# EAGLE design Master-Module (EAGLE 6.3)
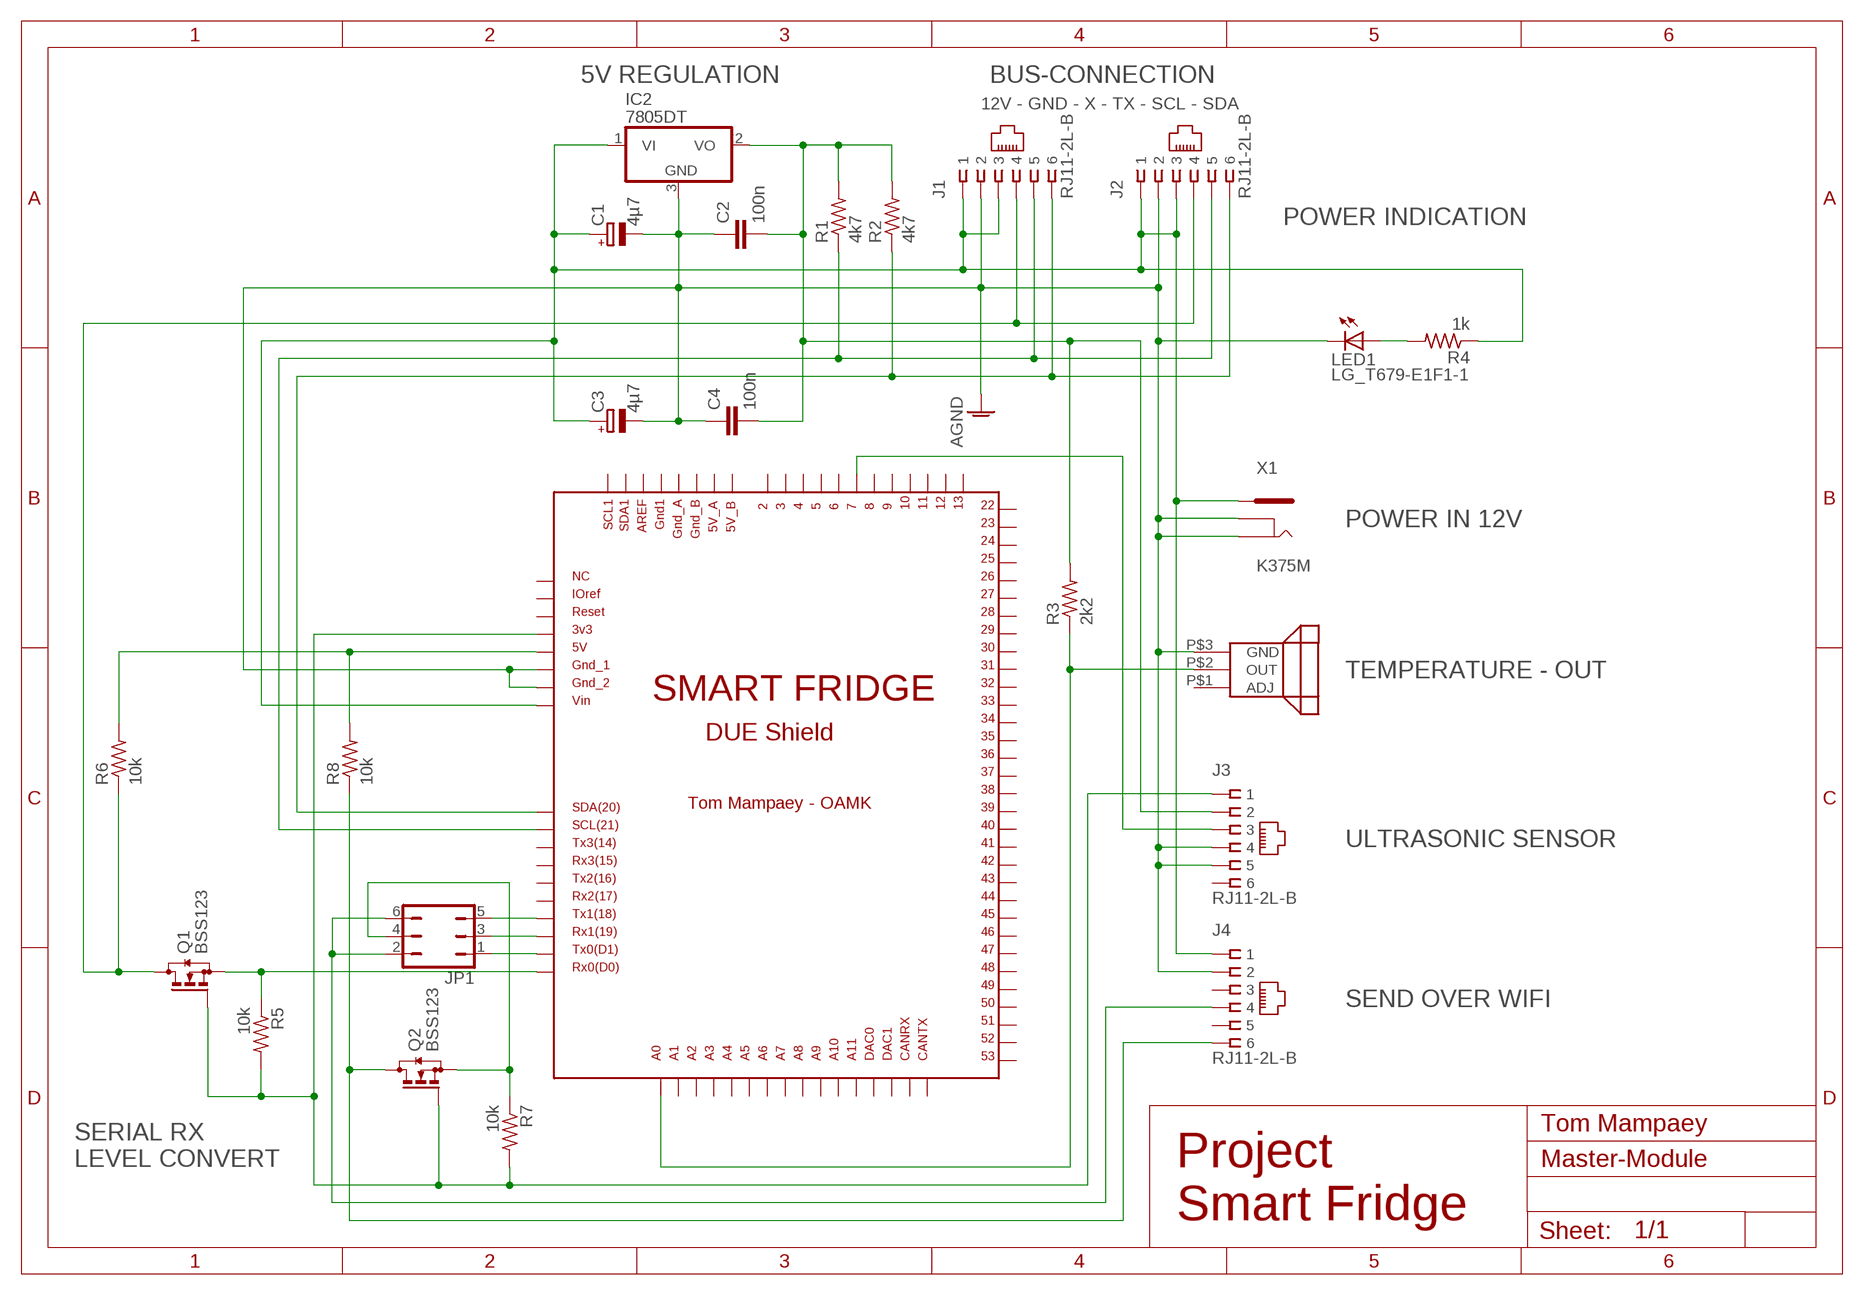
[diagram p0: schematic, sheet 1]

## Parts
C1  4µ7  CPOL-EUB  [PANASONIC_B]
C2  100n  C-EUC0603  [C0603]
C3  4µ7  CPOL-EUB  [PANASONIC_B]
C4  100n  C-EUC0603  [C0603]
IC2  7805DT  [TO252]
J1  RJ11-2L-B  [RJ11-NO_SHIELD]
J2  RJ11-2L-B  [RJ11-NO_SHIELD]
J3  RJ11-2L-B  [RJ11-NO_SHIELD]
J4  RJ11-2L-B  [RJ11-NO_SHIELD]
JP1  JP3Q  [JP3Q]
LED1  LG_T679-E1F1-1  [PLCC2]
Q1  BSS123  [SOT23]
Q2  BSS123  [SOT23]
R1  4k7  R-US_R0402  [R0402]
R2  4k7  R-US_R0402  [R0402]
R3  2k2  R-US_R0402  [R0402]
R4  1k  R-US_R0402  [R0402]
R5  10k  R-US_R0402  [R0402]
R6  10k  R-US_R0402  [R0402]
R7  10k  R-US_R0402  [R0402]
R8  10k  R-US_R0402  [R0402]
U$1  DUE(NORMAL)  [DUE(NORMAL)]
U$2  LM335  [LM335]
X1  K375M  [K375M]

## Nets
AGND: C1.- C2.1 C3.- C4.1 IC2.3(GND) J1.2 J2.2 J3.4 J3.5 J4.2 LED1.C U$1.GND_1 U$1.GND_2 U$2.P$3(GND) X1.P$1 X1.P$6
N$1: J1.6 J2.6 R2.1 U$1.SDA
N$2: J1.4 J2.4 Q1.3(D) R6.1
N$3: J1.5 J2.5 R1.1 U$1.SCL
N$4: R6.2 R8.2 U$1.5V
N$5: R3.1 U$1.A0 U$2.P$2(OUT)
N$6: J3.3 U$1.7
N$7: LED1.A R4.2
N$8: C2.2 C4.2 IC2.2(VO) J3.2 R1.2 R2.2 R3.2
N$9: Q1.2(S) R5.1 U$1.RX0
N$11: JP1.1 U$1.TX0
N$14: J3.1 Q1.1(G) Q2.1(G) R5.2 R7.2 U$1.3V3
N$30: JP1.3 U$1.RX1
N$31: JP1.5 U$1.TX1
N$33: J4.4 JP1.2 JP1.6
N$34: J4.6 Q2.3(D) R8.1
N$35: JP1.4 Q2.2(S) R7.1
N$47: C1.+ C3.+ IC2.1(VI) J1.1 J1.3 J2.1 J2.3 J4.1 R4.1 U$1.VIN X1.P$7
Unconnected: J3.6 J4.3 J4.5 U$1.2 U$1.3 U$1.4 U$1.5 U$1.5V_A U$1.5V_B U$1.6 U$1.8 U$1.9 U$1.10 U$1.11 U$1.12 U$1.13 U$1.22 U$1.23 U$1.24 U$1.25 U$1.26 U$1.27 U$1.28 U$1.29 U$1.30 U$1.31 U$1.32 U$1.33 U$1.34 U$1.35 U$1.36 U$1.37 U$1.38 U$1.39 U$1.40 U$1.41 U$1.42 U$1.43 U$1.44 U$1.45 U$1.46 U$1.47 U$1.48 U$1.49 U$1.50 U$1.51 U$1.52 U$1.53 U$1.A1 U$1.A2 U$1.A3 U$1.A4 U$1.A5 U$1.A6 U$1.A7 U$1.A8 U$1.A9 U$1.A10 U$1.A11 U$1.AREF U$1.CANRX U$1.CANTX U$1.DAC0 U$1.DAC1 U$1.GND1 U$1.GND_A U$1.GND_B U$1.IOREF U$1.NC U$1.RESET U$1.RX2 U$1.RX3 U$1.SCL1 U$1.SDA1 U$1.TX2 U$1.TX3 U$2.P$1(ADJ)

## Notes on the sheet
- 5V REGULATION | BUS-CONNECTION
- 12V - GND - X - TX - SCL - SDA
- POWER INDICATION
- POWER IN 12V
- TEMPERATURE - OUT
- ULTRASONIC SENSOR
- SEND OVER WIFI
- Tom Mampaey
- SERIAL RX 
  LEVEL CONVERT
- Project 
  Smart Fridge

## Library data of the parts
C1 C3 = resistor:CPOL-EU: POLARIZED CAPACITOR, European symbol
C2 C4 = resistor:C-EU: CAPACITOR, European symbol
IC2 = linear:78*: Positive VOLTAGE REGULATOR Source: http://cache.national.com/ds/LM/LM78L05.pdf http://www.fairchildsemi.com/ds/LM/LM7805.pdf
J1-J4 = con-tycoelectronics:RJ11: CORCOM Modular RJ Jacks No Shield Source: www.tycoelectronics.com .. ENG_DS_1654001_1099_RJ_L_0507.pdf; MF: TYCO ELECTRONICS; MPN: RJ11-2L-B; OC_FARNELL: unknown; OC_NEWARK: 83F4463
JP1 = jumper:JP3Q: JUMPER
LED1 = led:*_T679-?-1: LC TOPLED® Low Current LED Source: http://catalog.osram-os.com .. LG_LS_LY_T679_OBS.pdf; COLOR: green
Q1 Q2 = transistor-small-signal:BSS123: N-CHANNEL MOS FET
R1-R8 = rcl:R-US_: RESISTOR, American symbol
U$1 = DUE-shield custom:DUE(NORMAL)
U$2 = LM335:LM335
X1 = con-power c:K375M: K375M - DC POWER JACK 2.5mm/CENTRAL PIN Source: Data sheet <http://www.shallin.com/productview.aspx?itemnumber=K375M>

## Board
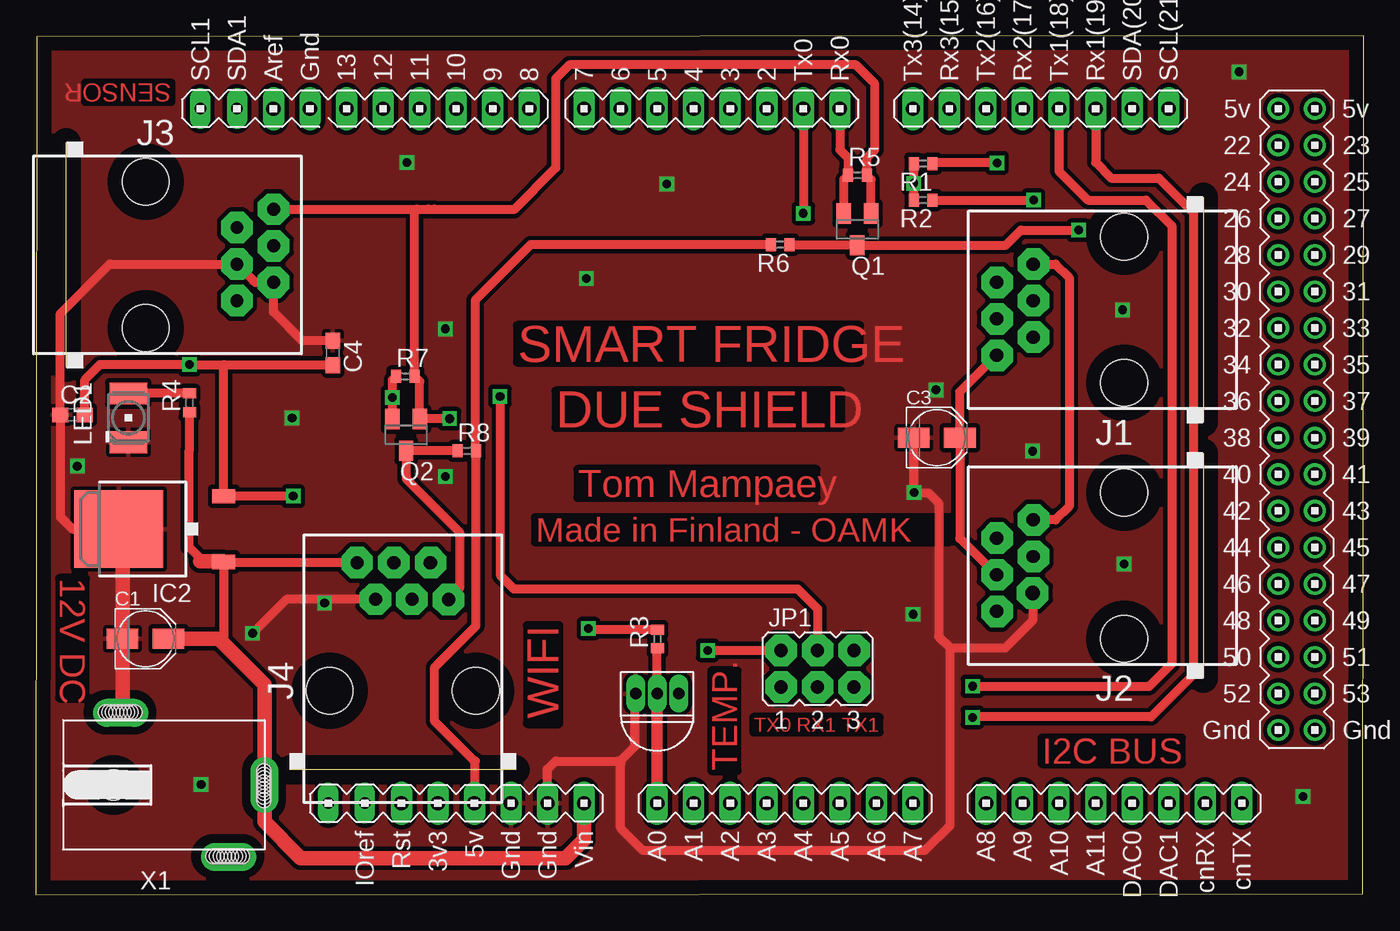
[diagram p1: board, top side]
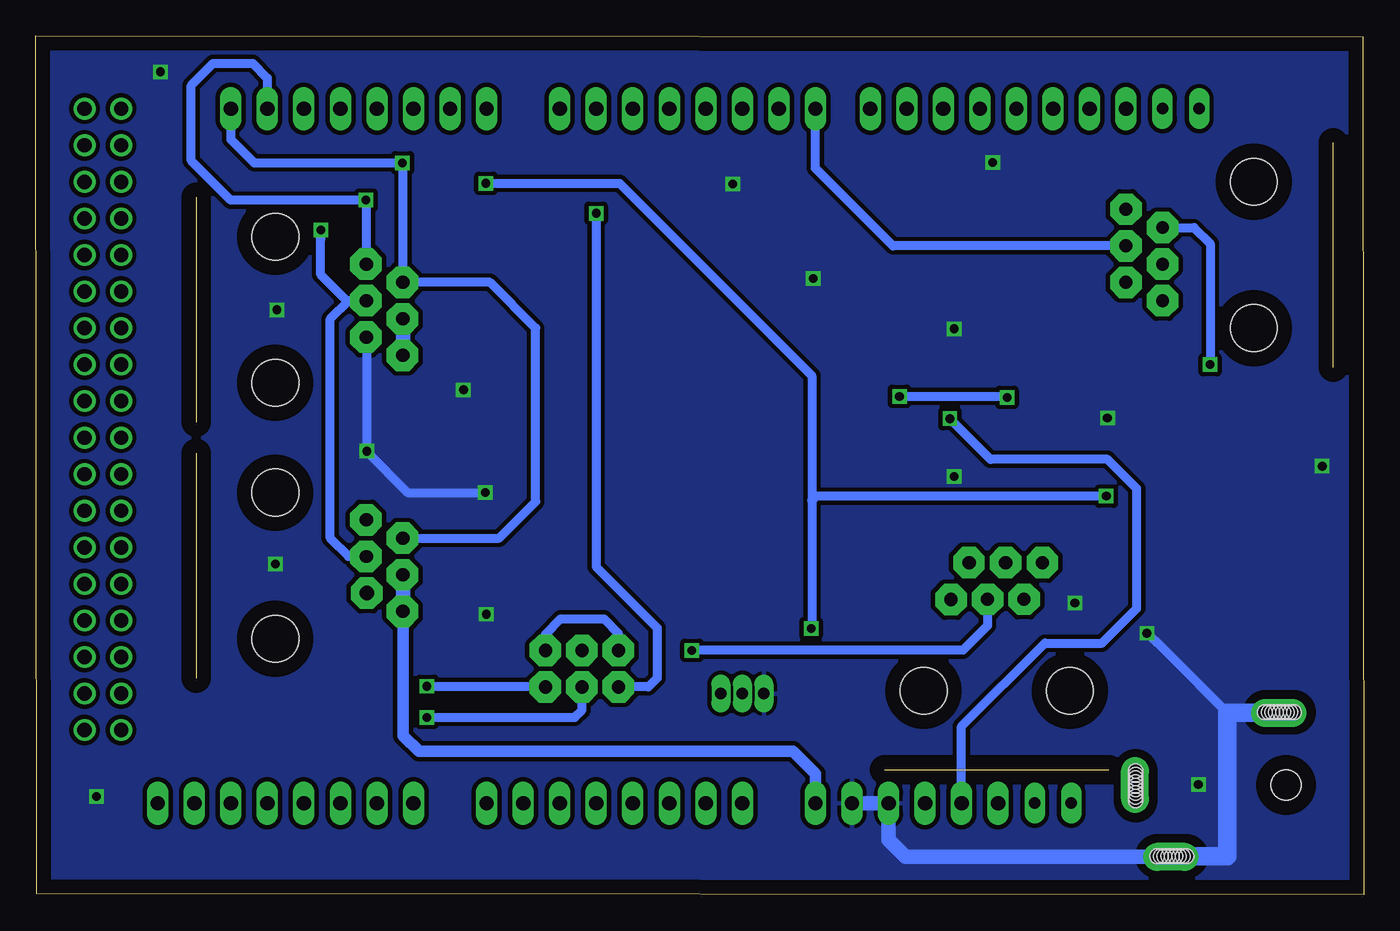
[diagram p2: board, bottom side, seen from below]

Size 92.28 x 59.66 mm. Coordinates in mm from the lower left corner, seen from the top.
Outline: 0,0 92.23,0.05 92.28,59.66 0.05,59.61 0,0
Copper layers (1*16): Top 0.035mm / dielectric 1.5mm / Bottom 0.035mm
Design rules "default": minimum track width 10mil, minimum drill 24mil, track to track 8mil, track to pad 8mil, pad to pad 8mil, via to via 8mil, smd to smd 8mil, copper to edge 40mil, drill to drill 8mil, minimum pad ring 10mil, minimum via ring 8mil, stop-mask expansion 4mil, vias tented up to drill 0mil, thermal gap 10mil

### Footprints (pad centres in the part's own frame; a part is rotated, then mirrored left to right if it is on the bottom)
PANASONIC_B = smd 2.2 x 1.4: + 1.6,0; - -1.6,0
C0603 = smd 1.1 x 1: 1 -0.85,0; 2 0.85,0
TO252 = smd 1 x 1.6: 1 -2.28,-4.8; 2 2.28,-4.8 | smd 5.4 x 6.2: 3 0,2.5
RJ11-NO_SHIELD = drill 0.9 pad 1.4: 1 -3.175,8.89; 2 -1.905,6.35; 3 -0.635,8.89; 4 0.635,6.35; 5 1.905,8.89; 6 3.175,6.35 | hole 3.251: -5.08,0; 5.08,0
JP3Q = drill 0.914 octagon: 1 -2.54,-1.27; 2 -2.54,1.27; 3 0,-1.27; 4 0,1.27; 5 2.54,-1.27; 6 2.54,1.27
PLCC2 = smd 2.6 x 1.5: A 0,1.7; C 0,-1.7
SOT23 = smd 1 x 1.4: 1 -0.95,-1.1; 2 0.95,-1.1; 3 0,1.1
R0402 = smd 0.7 x 0.9: 1 -0.65,0; 2 0.65,0
DUE(NORMAL) = drill 1 long: 2 -1.27,22.86; 3 -3.81,22.86; 3V3 -24.13,-25.4; 4 -6.35,22.86; 5 -8.89,22.86; 5V -21.59,-25.4; 6 -11.43,22.86; 7 -13.97,22.86; 8 -17.78,22.86; 9 -20.32,22.86; 10 -22.86,22.86; 11 -25.4,22.86; 12 -27.94,22.86; 13 -30.48,22.86; A0 -8.89,-25.4; A1 -6.35,-25.4; A2 -3.81,-25.4; A3 -1.27,-25.4; A4 1.27,-25.4; A5 3.81,-25.4; A6 6.35,-25.4; A7 8.89,-25.4; A8 13.97,-25.4; A9 16.51,-25.4; A10 19.05,-25.4; A11 21.59,-25.4; AREF -35.56,22.86; AREF1 -35.56,22.86; CANRX 29.21,-25.4; CANTX 31.75,-25.4; DAC0 24.13,-25.4; DAC1 26.67,-25.4; GND1 -33.02,22.86; GND_1 -19.05,-25.4; GND_2 -16.51,-25.4; RESET -26.67,-25.4; RX0 3.81,22.86; RX1 21.59,22.86; RX2 16.51,22.86; RX3 11.43,22.86; SCL 26.67,22.86; SDA 24.13,22.86; TX0 1.27,22.86; TX1 19.05,22.86; TX2 13.97,22.86; TX3 8.89,22.86; VIN -13.97,-25.4 | drill 1: 5V_A 34.29,22.86; 5V_B 36.83,22.86; 22 34.29,20.32; 23 36.83,20.32; 24 34.29,17.78; 25 36.83,17.78; 26 34.29,15.24; 27 36.83,15.24; 28 34.29,12.7; 29 36.83,12.7; 30 34.29,10.16; 31 36.83,10.16; 32 34.29,7.62; 33 36.83,7.62; 34 34.29,5.08; 35 36.83,5.08; 36 34.29,2.54; 37 36.83,2.54; 38 34.29,0; 39 36.83,0; 40 34.29,-2.54; 41 36.83,-2.54; 42 34.29,-5.08; 43 36.83,-5.08; 44 34.29,-7.62; 45 36.83,-7.62; 46 34.29,-10.16; 47 36.83,-10.16; 48 34.29,-12.7; 49 36.83,-12.7; 50 34.29,-15.24; 51 36.83,-15.24; 52 34.29,-17.78; 53 36.83,-17.78; GND_A 34.29,-20.32; GND_B 36.83,-20.32 | drill 0.8 pad 1.422 long: IOREF -29.21,-25.4; NC -31.75,-25.4; SCL1 -40.64,22.86; SDA1 -38.1,22.86
LM335 = drill 0.8 long: P$1 0,1.5; P$2 0,0; P$3 0,-1.5
K375M = drill 1 pad 1.93 long: P$1 5,3; P$6 -5,-4.5; P$7 0.004,-7.007 | hole 2.1: 0,3.5 | hole 1: -4.953,-3.429; -4.953,-3.683; -4.953,-3.937; -4.953,-4.191; -4.953,-4.445; -4.953,-4.699; -4.953,-4.953; -4.953,-5.207; -4.953,-5.461; -1.067,-6.96; -0.813,-6.96; -0.559,-6.96; -0.305,-6.96; -0.051,-6.96; 0.203,-6.96; 0.457,-6.96; 0.711,-6.96; 0.965,-6.96; 5.055,4.064; 5.055,3.81; 5.055,3.556; 5.055,3.302; 5.055,3.048; 5.055,2.794; 5.055,2.54; 5.055,2.286; 5.055,2.032

### Placement (x,y rotation side)
C1  7.62,17.78 0 top
C2  2.54,33.34 0 top
C3  62.62,31.75 0 top
C4  20.64,37.63 270 top
IC2  8.26,25.4 90 top
J1  75.64,40.64 90 top
J2  75.64,22.86 90 top
J3  7.62,44.45 270 top
J4  25.5,14.17 0 top
JP1  54.33,15.7 0 top
LED1  6.43,33.13 0 top
Q1  57.1,46.23 180 top
Q2  25.73,31.95 180 top
R1  61.67,50.8 180 top
R2  61.67,48.26 180 top
R3  43.21,17.75 90 top
R4  10.68,34.18 90 top
R5  57.1,49.99 0 top
R6  51.74,45.16 180 top
R7  25.68,36.02 0 top
R8  29.95,30.84 0 top
U$1  52.07,31.75 0 top
U$2  43.18,13.97 270 top
X1  8.89,7.62 90 top

### Tracks (layer width: path | path; a pad name or v marks a point on that pad's centre or on a via)
AGND  (via drill 0.6)
  Top 0.61: C3.- 61.04,31.74 v61.04,27.94 61.01,27.91 62.03,27.91 62.76,27.18 62.76,17.93 63.55,17.14 | IC2.3 2.54,25.4 1.69,26.25 C2.1 1.69,40.37 5.13,43.81 J3.4 15.24,42.55 J3.5 16.51,40.49 18.52,38.48 C4.1 | 40.64,9.09 40.64,4.62 42.22,3.05 61.77,3.05 63.55,4.83 63.55,17.14 | 40.64,9.09 40.64,9.3 41.66,10.31 41.66,13.95 U$2.P$3 | 63.55,17.14 67.39,17.14 69.29,19.05 J2.2 | U$1.GND_2 35.56,8.71 36.12,9.27 40.46,9.27 40.64,9.09 | J4.2 17.42,20.52 v15.06,18.16
  Top 1.016: X1.P$1 6.02,12.75 C1.- 6.02,24.43 6.99,25.4 IC2.3
  Bottom 0.61: J1.2 69.29,30.8 66.43,27.94 v61.04,27.94 | v15.06,18.16 14.38,17.53 9.47,12.62
  Bottom 1.016: U$1.GND_2 U$1.GND_1 33.02,3.81 31.83,2.62 X1.P$6 13.31,2.54
  Bottom 1.27: X1.P$1 9.47,12.62 9.47,2.67 13.39,2.67 X1.P$6
  other vias: 69.29,30.81 25.78,50.88 43.84,49.38 28.45,39.32 17.81,33.12 88.09,6.81 60.99,19.48 75.64,22.96 75.54,40.64 11.48,7.65 83.64,57.18 38.25,42.82 20.07,20.27 2.87,29.77 62.56,35.08 28.45,29.06
  pour Bottom (isolate 0.305): 92.23,59.59 92.23,0.05 0.05,0.05 0.05,59.59 0.1,59.59
  pour Top (isolate 0.305): 0.05,59.61 92.23,59.61 92.23,0.05 0.05,0.05
N$1  (via drill 0.6)
  Top 0.61: R2.1 v69.34,48.26 | J1.6 70.88,43.81 71.83,42.86 71.83,26.99 70.88,26.04 J2.6
  Bottom 0.61: U$1.SDA 76.2,56.74 77.22,57.76 79.96,57.76 81.48,56.24 81.48,51 78.74,48.26 v69.34,48.26 69.29,48.21 J1.6
N$2  (via drill 0.6)
  Top 0.61: v72.47,46.18 68.48,46.18 67.43,45.13 Q1.3 52.56,45.13 R6.1
  Bottom 0.61: J2.4 70.56,23.5 71.83,24.77 71.83,40.01 70.56,41.27 | J1.4 70.56,41.27 | 70.56,41.27 70.69,41.27 72.49,43.08 72.49,45.54 v72.47,46.18
N$3  (via drill 0.6)
  Top 0.61: v66.8,50.85 62.37,50.85 R1.1
  Bottom 0.61: J2.5 60.08,24.77 57.54,27.3 57.54,39.37 60.72,42.55 J1.5 66.75,50.8 v66.8,50.85 77.11,50.85 78.74,52.48 U$1.SCL
N$4
  Top 0.61: U$1.5V 30.53,6.4 30.53,9.3 30.45,9.3 27.71,12.04 27.71,15.8 30.58,18.67 30.58,30.82 R8.2 30.53,30.9 30.53,41.3 34.39,45.16 R6.2
N$5
  Top 0.61: U$2.P$2 43.18,17.08 R3.1
  Top 0.813: U$1.A0 U$2.P$2
N$6
  Bottom 0.61: J3.3 32.7,45.09 38.1,50.48 U$1.7
N$7
  Top 0.61: R4.2 LED1.A
N$8  (via drill 0.6)
  Top 0.61: C2.2 3.39,35.77 4.45,36.83 v10.67,36.83 13.06,36.83 | R1.2 R2.2 61.02,49.42 60.96,49.48 61.01,49.58 v61.01,49.43 | 38.48,18.41 v38.41,18.49 38.49,18.41 R3.2 | v17.88,27.69 IC2.2 | IC2.2 | 13.06,36.83 20.64,36.83 C4.2 | IC2.2 13.06,36.83
  Bottom 0.61: v61.01,49.43 51.71,49.43 38.35,36.07 38.35,27.38 | 38.35,27.38 38.35,18.54 v38.41,18.49 | v17.88,27.69 38.05,27.69 38.35,27.38 | J3.2 11.79,46.35 10.67,45.24 v10.67,36.83
N$9
  Top 0.61: Q1.2 56.15,49.69 R5.1 56.44,51.21 55.88,51.77 U$1.RX0
N$11  (via drill 0.6)
  Top 0.61: U$1.TX0 v53.34,47.35
  Bottom 0.61: v53.34,47.35 53.34,22.78 49.1,18.54 49.1,15.04 49.71,14.43 JP1.1
N$12  (via drill 0.9 pad 2.18)
  other vias: 13.97,46.35
N$13  (via drill 0.9 pad 2.18)
  other vias: 16.51,45.09
N$14  (via drill 0.6, 0.9 pad 2.18)
  Top 0.61: J3.1 26.47,47.62 | 26.47,47.62 27.28,47.62 | 27.28,47.62 27.69,47.62 | Q1.1 58.05,49.69 R5.2 57.75,51.2 58.32,51.77 58.32,56.34 57,57.66 37.08,57.66 36.12,56.69 36.12,50.49 33.22,47.6 27.3,47.6 27.28,47.62 | 26.47,47.62 26.33,47.49 R7.2 26.68,35.67 Q2.1 26.7,33.07 v28.75,33.07
  Bottom 0.61: U$1.3V3 27.94,11.68 22.15,17.48 18.19,17.48 15.77,19.89 15.77,28.22 17.8,30.25 25.93,30.25 v28.75,33.07
  other vias: 16.51,47.62
N$15  (via drill 0.9 pad 2.18)
  other vias: 13.97,43.81
N$16  (via drill 0.9 pad 2.18)
  other vias: 16.51,42.55
N$17  (via drill 0.9 pad 2.18)
  other vias: 13.97,41.27
N$18  (via drill 0.9 pad 2.18)
  other vias: 69.34,43.81
N$19  (via drill 0.9 pad 2.18)
  other vias: 66.8,42.55
N$20  (via drill 0.9 pad 2.18)
  other vias: 69.34,41.27
N$21  (via drill 0.9 pad 2.18)
  other vias: 66.8,40.01
N$22  (via drill 0.9 pad 2.18)
  other vias: 66.8,37.47
N$23  (via drill 0.9 pad 2.18)
  other vias: 69.34,26.04
N$24  (via drill 0.9 pad 2.18)
  other vias: 69.34,23.5
N$25  (via drill 0.9 pad 2.18)
  other vias: 66.8,22.23
N$26  (via drill 0.9 pad 2.18)
  other vias: 66.8,19.68
N$27  (via drill 0.9 pad 2.18)
  other vias: 69.34,38.73
N$28  (via drill 0.9 pad 2.18)
  other vias: 66.8,24.77
N$29  (via drill 1 pad 2.18)
  other vias: 69.29,20.95
N$30  (via drill 0.6)
  Top 0.61: U$1.RX1 73.66,50.88 74.75,49.78 78.05,49.78 80.47,47.37 80.47,15.29 77.52,12.34 65.13,12.34 v65.1,12.32
  Bottom 0.61: v65.1,12.32 54.84,12.32 54.33,12.83 JP1.3
N$31  (via drill 0.6)
  Top 0.61: U$1.TX1 71.12,50.27 73.13,48.26 77.17,48.26 78.94,46.48 78.94,16.03 77.37,14.45 65.13,14.45 v65.1,14.48
  Bottom 0.61: v65.1,14.48 56.92,14.48 JP1.5
N$32  (via drill 0.9 pad 2.18)
  other vias: 22.33,23.06
N$33  (via drill 0.6)
  Top 0.61: v46.69,16.97 JP1.2
  Bottom 0.61: JP1.6 56.87,18.09 55.8,19.15 52.81,19.15 51.79,18.14 JP1.2 | J4.4 26.14,18.69 27.84,16.99 46.66,16.99 v46.69,16.97
N$34
  Top 0.61: J4.6 29.44,21.29 29.44,25.2 25.73,28.91 Q2.3 25.75,30.84 R8.1
N$35  (via drill 0.6)
  Top 0.61: Q2.2 v24.78,34.54 24.78,35.77 R7.1 | JP1.4 54.36,16.97 54.36,19.84 52.96,21.23 33.22,21.23 32.31,22.15 32.31,34.42 32.28,34.44 32.28,34.59 v32.26,34.62
  Bottom 0.61: v32.26,34.62 24.86,34.62 v24.78,34.54
N$36  (via drill 0.9 pad 2.18)
  other vias: 24.89,23.06
N$37  (via drill 0.9 pad 2.18)
  other vias: 27.43,23.06
N$38  (via drill 0.9 pad 2.18)
  other vias: 28.68,20.5
N$39  (via drill 0.9 pad 2.18)
  other vias: 26.14,20.52
N$40  (via drill 0.9 pad 2.18)
  other vias: 23.6,20.52
N$41  (via drill 0.9 pad 2.18)
  other vias: 51.79,14.43
N$42  (via drill 0.9 pad 2.18)
  other vias: 51.79,16.97
N$43  (via drill 0.9 pad 2.18)
  other vias: 54.33,16.97
N$44  (via drill 0.9 pad 2.18)
  other vias: 54.33,14.43
N$45  (via drill 0.9 pad 2.18)
  other vias: 56.87,16.97
N$46  (via drill 0.9 pad 2.18)
  other vias: 56.87,14.43
N$47
  Top 0.61: J2.3 64.22,24.75 C3.+ 64.22,34.94 J1.1 | 12.95,17.53 13.05,17.63 IC2.1 13.05,23.06 J4.1 | 11.43,23.18 11.43,23.37 10.67,24.13 10.67,30.89 10.68,30.89 R4.1
  Top 1.016: U$1.VIN 38.1,3.81 36.83,2.54 18.41,2.54 15.9,5.06 X1.P$7 15.9,14.58 12.95,17.53 12.7,17.78 C1.+ | 11.43,23.18 13,23.18 IC2.1
  Bottom 0.813: U$1.VIN 38.1,8.38 39.67,9.96 65.66,9.96 66.75,11.05 J2.1
  Bottom 1.016: J1.1 J1.3 | J2.1 J2.3

### Text on the board
Top: SENSOR | SMART FRIDGE | DUE SHIELD | Tom Mampaey | Made in Finland - OAMK | 12V DC | WIFI | TX0 RX1 TX1 | TEMP. | I2C BUS